# EAGLE schematic FqMeterBF (EAGLE 7.6.0)
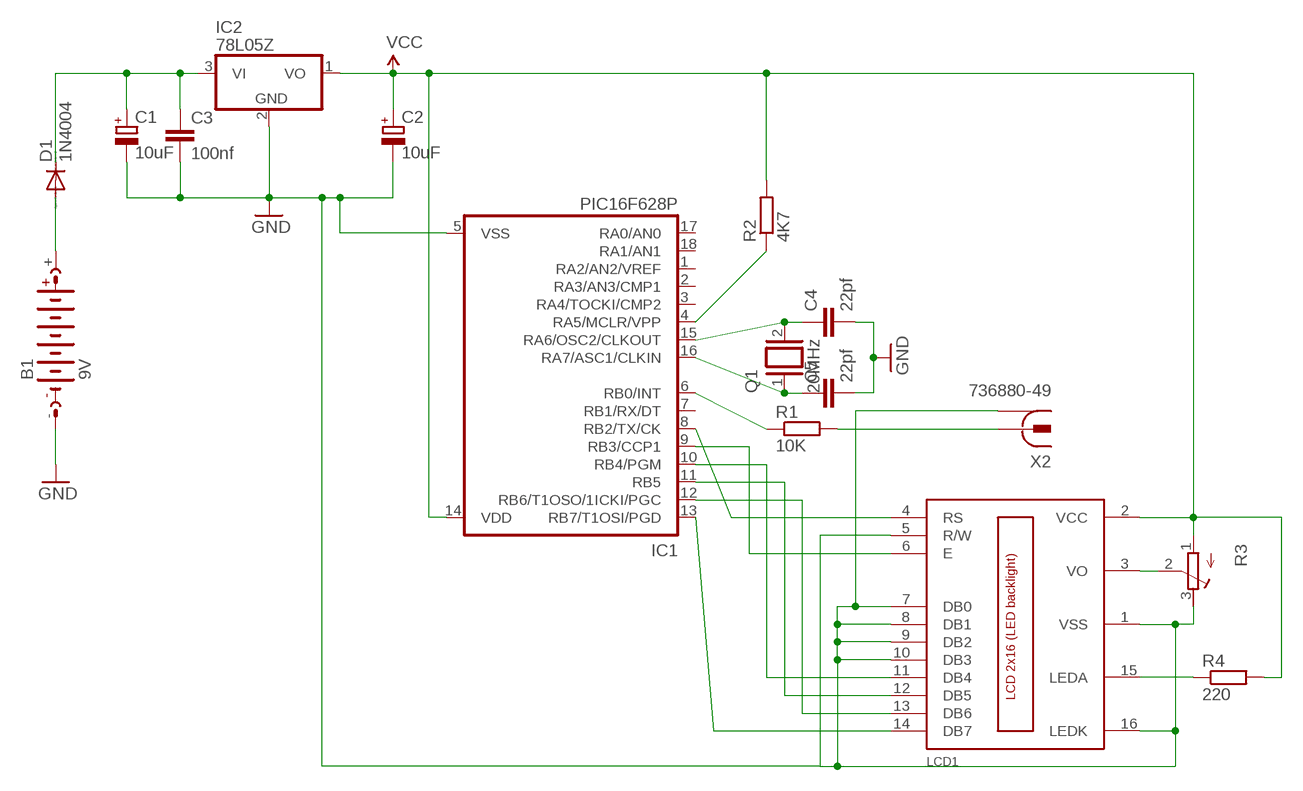
[diagram p0: schematic, sheet 1]

## Parts
B1  9V  AB9V  [AB9V]
C1  10uF  CPOL-EUE2-4  [E2-4]
C2  10uF  CPOL-EUE2-4  [E2-4]
C3  100nf  C-EU050-025X075  [C050-025X075]
C4  22pf  C-EU050-025X075  [C050-025X075]
C5  22pf  C-EU050-025X075  [C050-025X075]
D1  1N4004  [DO41-10]
IC1  PIC16F628P  [DIL18]
IC2  78L05Z  [TO92]
LCD1  LCD_2X16  [HY-1602F]
Q1  20MHz  XTAL/S  [QS]
R1  10K  R-EU_0207/12  [0207/12]
R2  4K7  R-EU_0207/12  [0207/12]
R3  R-TRIMM3339P  [RTRIM3339P]
R4  220  R-EU_0207/12  [0207/12]
X2  736880-49  [736880-49]

## Nets
GND: B1.- C1.- C2.- C3.2 C4.2 C5.2 IC1.5(VSS) IC2.2(GND) LCD1.1(VSS) LCD1.5(R/W) LCD1.7(DB0) LCD1.8(DB1) LCD1.9(DB2) LCD1.10(DB3) LCD1.16(LEDK) R3.3(E) X2.1 X2.1@1 X2.1@2
N$1: LCD1.15(LEDA) R4.1
N$2: C4.1 IC1.15(RA6/OSC2/CLKOUT) Q1.2
N$3: C5.1 IC1.16(RA7/ASC1/CLKIN) Q1.1
N$4: IC1.6(RB0/INT) R1.1
N$5: IC1.4(RA5/MCLR/VPP) R2.1
N$6: B1.+ D1.A
N$7: C1.+ C3.1 D1.C IC2.3(VI)
N$8: IC1.8(RB2/TX/CK) LCD1.4(RS)
N$9: IC1.9(RB3/CCP1) LCD1.6(E)
N$10: R1.2 X2.2
N$11: LCD1.3(VO) R3.2(S)
N$12: IC1.10(RB4/PGM) LCD1.11(DB4)
N$13: IC1.11(RB5) LCD1.12(DB5)
N$14: IC1.12(RB6/T1OSO/1ICKI/PGC) LCD1.13(DB6)
N$15: IC1.13(RB7/T1OSI/PGD) LCD1.14(DB7)
N$16: C2.+ IC1.14(VDD) IC2.1(VO) LCD1.2(VCC) R2.2 R3.1(A) R4.2 ; supply symbol labelled VCC
Unconnected: IC1.1(RA2/AN2/VREF) IC1.2(RA3/AN3/CMP1) IC1.3(RA4/TOCKI/CMP2) IC1.7(RB1/RX/DT) IC1.17(RA0/AN0) IC1.18(RA1/AN1)

## Library data of the parts
B1 = battery:AB9V: 9-V BATTERY CLIP
C1 C2 = rcl:CPOL-EU: POLARIZED CAPACITOR, European symbol
C3-C5 = rcl:C-EU: CAPACITOR, European symbol
D1 = diode:1N4004: DIODE general purpose rectifier, 1 A
IC1 = microchip:PIC16*F62: FLASH-Based 8-Bit CMOS Microcontroller Source: http://ww1.microchip.com/downloads/en/DeviceDoc/40300C.pdf; MF: MICROCHIP; MPN: PIC16F628-20/P; OC_FARNELL: 9760423; OC_NEWARK: 23C4982
IC2 = linear:78*: Positive VOLTAGE REGULATOR Source: http://cache.national.com/ds/LM/LM78L05.pdf http://www.fairchildsemi.com/ds/LM/LM7805.pdf
LCD1 = lcd_2x16_HD44780_led_backlight:LCD_2X16
Q1 = special:XTAL/S: CRYSTAL
R1 R2 R4 = rcl:R-EU_: RESISTOR, European symbol
R3 = rcl:R-TRIMM: Trimm resistor
X2 = con-conrad:736880-49: Cinch Connector ( RCA Jack ) Cinch-Einbaukupplung 90º 72345 Vernickelt BKL Electronic Source: Conrad <http://www.conrad.de/ce/de/product/736880>